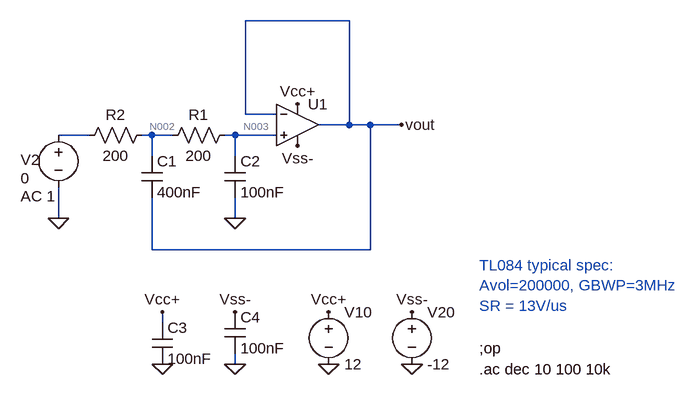
[diagram p0: schematic x7620_template.asc]
x7620_template.asc, the LTspice schematic file:
Version 4
SHEET 1 880 680
WIRE -16 -48 -176 -48
WIRE -176 96 -176 -48
WIRE -128 96 -176 96
WIRE -16 112 -16 -48
WIRE -16 112 -64 112
WIRE 16 112 -16 112
WIRE 64 112 16 112
WIRE -416 128 -464 128
WIRE -320 128 -336 128
WIRE -288 128 -320 128
WIRE -192 128 -208 128
WIRE -128 128 -192 128
WIRE -320 160 -320 128
WIRE -192 160 -192 128
WIRE -464 256 -464 208
WIRE -192 256 -192 224
WIRE -320 304 -320 224
WIRE 16 304 16 112
WIRE 16 304 -320 304
WIRE -304 416 -304 400
WIRE -192 480 -192 464
FLAG -464 256 0
FLAG -48 480 0
FLAG 80 480 0
FLAG -48 400 Vcc+
FLAG 80 400 Vss-
FLAG -96 144 Vss-
FLAG -96 80 Vcc+
FLAG -192 256 0
FLAG 64 112 vout
FLAG -304 400 Vcc+
FLAG -192 400 Vss-
FLAG -304 480 0
FLAG -192 480 0
SYMBOL voltage -48 384 R0
WINDOW 123 0 0 Left 2
WINDOW 39 0 0 Left 2
SYMATTR InstName V10
SYMATTR Value 12
SYMBOL voltage 80 384 R0
WINDOW 123 0 0 Left 2
WINDOW 39 0 0 Left 2
SYMATTR InstName V20
SYMATTR Value -12
SYMBOL Opamps\\UniversalOpamp2 -96 112 R0
SYMATTR InstName U1
SYMATTR Value2 Avol=200000 GBW=3Meg Slew=13Meg
SYMBOL voltage -464 112 R0
WINDOW 0 -58 54 Left 2
WINDOW 3 -58 82 Left 2
WINDOW 123 -58 110 Left 2
WINDOW 39 0 0 Left 2
SYMATTR InstName V2
SYMATTR Value 0
SYMATTR Value2 AC 1
SYMBOL res -192 112 R90
WINDOW 0 0 56 VBottom 2
WINDOW 3 32 56 VTop 2
SYMATTR InstName R1
SYMATTR Value 200
SYMBOL res -320 112 R90
WINDOW 0 0 56 VBottom 2
WINDOW 3 32 56 VTop 2
SYMATTR InstName R2
SYMATTR Value 200
SYMBOL cap -208 160 R0
SYMATTR InstName C2
SYMATTR Value 100nF
SYMBOL cap -336 160 R0
SYMATTR InstName C1
SYMATTR Value 400nF
SYMBOL cap -320 416 R0
SYMATTR InstName C3
SYMATTR Value 100nF
SYMBOL cap -208 400 R0
SYMATTR InstName C4
SYMATTR Value 100nF
TEXT 184 456 Left 2 !;op
TEXT 184 488 Left 2 !.ac dec 10 100 10k
TEXT 184 328 Left 2 ;TL084 typical spec:\nAvol=200000, GBWP=3MHz\nSR = 13V/us

The netlist it stands for:
* x7620_template.asc
V10 Vcc+ 0 12
V20 Vss- 0 -12
XU1 N003 vout Vcc+ Vss- vout level.2 Avol=200000 GBW=3Meg Slew=13Meg ilimit=25m rail=0 Vos=0 phimargin=45 en=0 enk=0 in=0 ink=0 Rin=500Meg  ; pins IN+ IN- V+ V- OUT
V2 N001 0 0 AC 1
R1 N003 N002 200
R2 N002 N001 200
C2 N003 0 100nF
C1 N002 vout 400nF
C3 Vcc+ 0 100nF
C4 Vss- 0 100nF
;op
.ac dec 10 100 10k
* TL084 typical spec:
* Avol=200000, GBWP=3MHz
* SR = 13V/us
.lib UniversalOpamps2.sub
.backanno
.end

* Results of the author's LTspice run, read from the files saved beside the schematic
* Operating Point, zero values left out:
*   V(vcc+) = 12 V
*   V(vss-) = -12 V
*   I(V20) = 1.199 mA
*   I(V10) = -1.199 mA
*   Ix(u1:3) = 1.199 mA
*   Ix(u1:4) = -1.199 mA
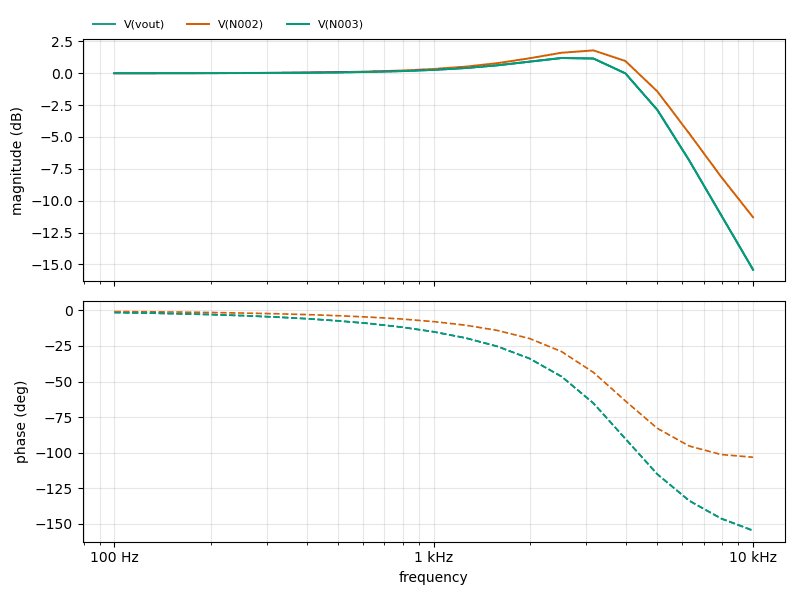
[diagram p1: AC Analysis of x7620_template.asc, plotted from the saved traces]
* AC Analysis, 1 run:
*   V(vout): 0.00 dB at 100 Hz, -15.42 dB at 10 kHz, peak 1.20 dB at 2.512 kHz, 3 dB below the peak at 4.604 kHz
*   V(N002): 0.00 dB at 100 Hz, -11.30 dB at 10 kHz, peak 1.79 dB at 3.162 kHz, 3 dB below the peak at 4.915 kHz
*   V(N003): 0.00 dB at 100 Hz, -15.42 dB at 10 kHz, peak 1.20 dB at 2.512 kHz, 3 dB below the peak at 4.604 kHz